# Altium project Hydra A1 UCLO 35131D.PrjPCB (part 11 of 14)
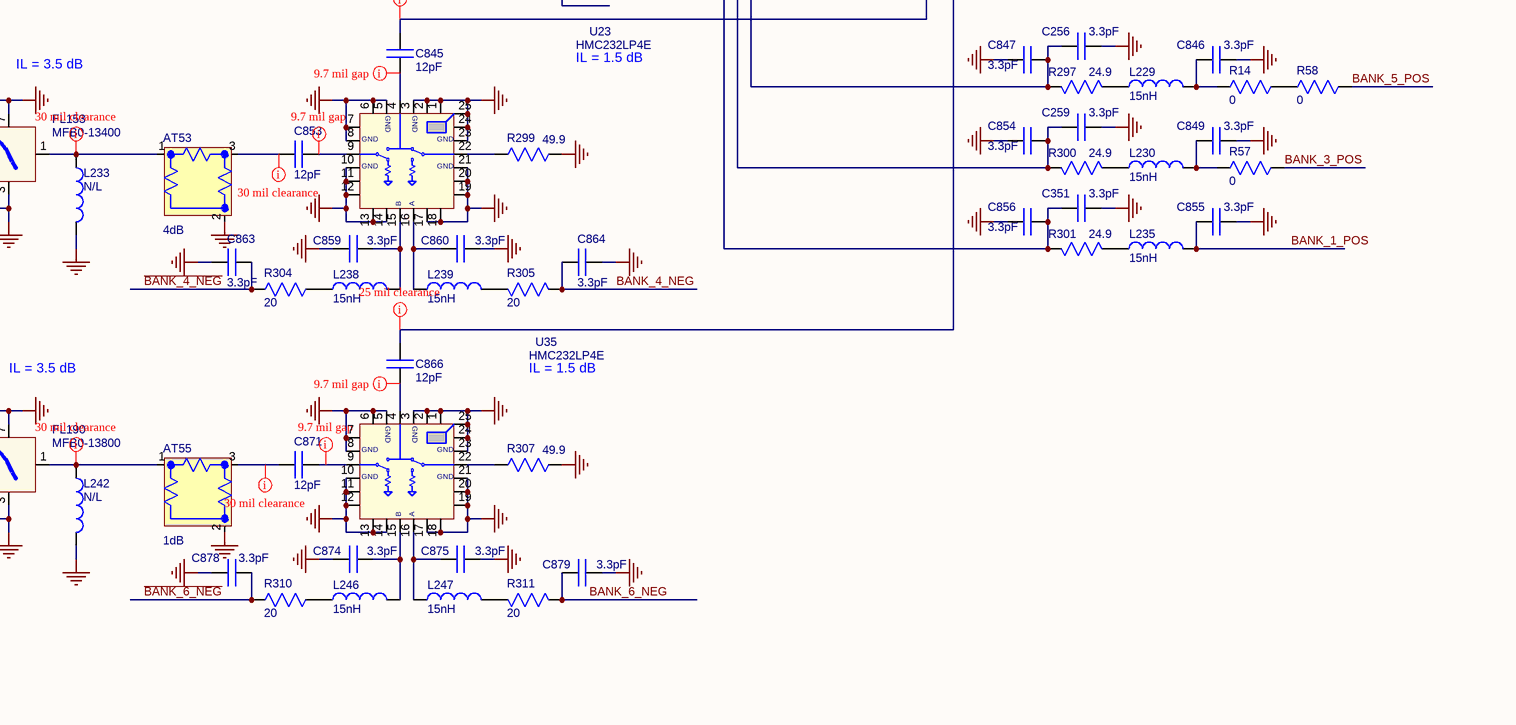
[diagram p75: STALO_2.SchDoc, bottom right]

## Sheet STALO_2.SchDoc: STALO_2 (continued)

### Library data of the parts
AT2 AT5 AT9 AT11 AT15 AT54 AT59 AT62 = MPFC-A1002: NoLoad: .; Approved: CL; M_PN: IMS1141-02DB; MFGR: IMS RESISTORS; level: 1; line_number: 10; ModifyDate: 3/8/13; G_PN: MPFC-A1002; item_number: MPFC-A1002
AT4 AT7 AT8 AT13 AT53 AT57 = MPFC-A1004: NoLoad: .; Approved: CL; M_PN: IMS1141-04DB; MFGR: IMS RESISTORS; level: 1; line_number: 30; ModifyDate: 3/8/13; G_PN: MPFC-A1004; item_number: MPFC-A1004
AT55 = MPFC-A1001: NoLoad: .; Approved: CL; M_PN: IMS1141-01DB; MFGR: IMS RESISTORS; level: 1; line_number: 15; ModifyDate: 3/8/13; G_PN: MPFC-A1001; item_number: MPFC-A1001
AT61 = MPFC-A1000: NoLoad: .; Approved: CL; M_PN: IMS1141-00DB; MFGR: IMS RESISTORS; level: 1; line_number: 50; ModifyDate: 4/16/13; G_PN: MPFC-A1000; item_number: MPFC-A1000
C18 C20 C25 C29 C111 C113 C114 C116 C188 C200 C201 C203 C401 C722 C822 C828 C829 C831 C845 C850 C851 C853 C866 C868 C869 C871 C881 = CK40-00120: Approved: CL; NoLoad: .; MFGR: ANY; level: 1; line_number: 165; G_PN: CK40-00120; ModifyDate: 10/06/12; M_PN: ANY; item_number: CK40-00120
C102-C105 C108 C109 C117 C118 C148-C152 C175-C179 C182-C186 C191-C193 C195-C199 C232-C234 C241 C253-C256 C259 C351-C357 C365-C367 C399 C400 C826 C827 C832-C839 C842 C843 C846 C847 C849 C854-C864 C872-C879 = CK35-00033: MFGR: VENKEL; M_PN: C0201C0G500-3R3BNP; Approved: CL; NoLoad: .; level: 1; line_number: 155; ModifyDate: 6/24/13; G_PN: CK35-00033; item_number: CK35-00033
C106 C107 C115 C180 C181 C840 C841 C886 C891 C893 C953-C955 C965-C967 = CK41-00024: MFGR: ATC; M_PN: 600L2R4AT200; Approved: CL; NoLoad: .; level: 1; line_number: 60; ModifyDate: 02/09/13; G_PN: CK41-00024; item_number: CK41-00024
C189 C190 C823 C825 C892 = CK40-04100: Approved: CL; MFGR: VENKEL; M_PN: C0402X7R160-104KNP; NoLoad: .; level: 1; line_number: 95; ModifyDate: 3/29/13; G_PN: CK40-04100; item_number: CK40-04100
C361 C961 C1224 = CK45-04100: Approved: CL; NoLoad: .; MFGR: ANY; level: 1; line_number: 105; ModifyDate: 02/22/12; G_PN: CK45-04100; M_PN: ANY; item_number: CK45-04100
C402 C956-C958 C968 = TCC3-03100: Approved: CL; NoLoad: .; MFGR: ATC; M_PN: ATC520L103KT16T; level: 1; line_number: 90; G_PN: TCC3-03100; ModifyDate: 4/26/13; item_number: TCC3-03100
C727 C730 C952 C962-C964 = CK40-00120: MFGR: ANY; Approved: CL; NoLoad: .; level: 1; line_number: 165; ModifyDate: 10/06/12; M_PN: ANY; G_PN: CK40-00120; item_number: CK40-00120
C880 C883 C885 = CK40-00330: Approved: CL; MFGR: ANY; NoLoad: .; level: 1; line_number: 295; ModifyDate: 3/9/13; G_PN: CK40-00330; M_PN: ANY; item_number: CK40-00330
C882 = CK41-00018: Approved: CL; NoLoad: .; M_PN: 600L1R8AT200; MFGR: ATC; level: 1; line_number: 175; G_PN: CK41-00018; ModifyDate: 02/09/13; item_number: CK41-00018
C884 = CK41-00007: Approved: CL; NoLoad: .; M_PN: 600L0R7AT200; MFGR: ATC; level: 1; line_number: 300; G_PN: CK41-00007; ModifyDate: 4/9/13; item_number: CK41-00007
C887-C890 = CK40-01100: MFGR: Any; Approved: CL; NoLoad: .; level: 1; line_number: 70; ModifyDate: 3/21/12; M_PN: Any; G_PN: CK40-01100; item_number: CK40-01100
C959 = CK40-00120: Approved: CL; MFGR: ANY; level: 1; line_number: 165; G_PN: CK40-00120; ModifyDate: 10/06/12; M_PN: ANY; item_number: CK40-00120
C969 C970 C1225-C1229 = CK40-01470: Approved: CL; MFGR: Any; NoLoad: .; level: 1; line_number: 75; ModifyDate: 02/22/12; G_PN: CK40-01470; M_PN: Any; item_number: CK40-01470
FL11 FL22 FL23 FL45 FL49 FL50 = LFS0-00222: Approved: CL; NoLoad: .; M_PN: NFE31PT222Z1E9BL; MFGR: MURATA; level: 1; line_number: 335; G_PN: LFS0-00222; ModifyDate: 02/22/12; Value: 2200pF; item_number: LFS0-00222
FL27 FL28 = MFB0-13600: Approved: CL; NoLoad: .; Value: 940685; MFGR: IMC; level: 1; line_number: 385; ModifyDate: 5/30/13; M_PN: 940685; G_PN: MFB0-13600; item_number: MFB0-13600
FL29 FL33 = MFB0-13200: Approved: CL; MFGR: IMC; NoLoad: .; Value: 940683; level: 1; line_number: 410; ModifyDate: 5/30/13; M_PN: 940683; G_PN: MFB0-13200; item_number: MFB0-13200
FL34 FL37 = MFB0-12800: Approved: CL; MFGR: IMC; NoLoad: .; Value: 940681; level: 1; line_number: 430; ModifyDate: 5/30/13; M_PN: 940681; G_PN: MFB0-12800; item_number: MFB0-12800
FL39 FL48 = MFL0-03900: NoLoad: .; MFGR: Mini-Circuits; Approved: NM; level: 1; line_number: 440; ModifyDate: 11/17/12; M_PN: LFCN-3800; G_PN: MFL0-03900; item_number: MFL0-03900
FL43 FL151 = MFB0-13000: Approved: CL; MFGR: IMC; NoLoad: .; Value: 940682; level: 1; line_number: 455; ModifyDate: 5/30/13; M_PN: 940682; G_PN: MFB0-13000; item_number: MFB0-13000
FL47 FL51 = LFS0-00250: Approved: NM; NoLoad: .; M_PN: NFL18ST207X1C3; MFGR: MURATA; level: 1; line_number: 415; ModifyDate: 02/22/12; Value: 25pF; G_PN: LFS0-00250; item_number: LFS0-00250
FL152 FL153 = MFB0-13400: Approved: CL; MFGR: IMC; NoLoad: .; Value: 940684; level: 1; line_number: 345; ModifyDate: 5/30/13; M_PN: 940684; G_PN: MFB0-13400; item_number: MFB0-13400
FL173 FL190 = MFB0-13800: Approved: CL; NoLoad: .; Value: 940686; MFGR: IMC; level: 1; line_number: 355; ModifyDate: 5/30/13; M_PN: 940686; G_PN: MFB0-13800; item_number: MFB0-13800
FL500 FL501 FL506 = LFS0-00222: Filter EMI 2200PF,1206; Approved: CL; NoLoad: .; M_PN: NFE31PT222Z1E9BL; MFGR: MURATA; level: 1; line_number: 335; G_PN: LFS0-00222; ModifyDate: 02/22/12; Value: 2200pF; item_number: LFS0-00222
FT7 FT18 FT33 = FromToNode: level: 1; Approved: *; G_PN: *; MFGR: *; Value: *
J2 = JRSM-70101: SMPM FD MALE,STRAIGHT SMT, R/A COPLANAR, 4 PIN THRU-HOLE; Value: B012-P93-02; MFGR: GILBERT; Approved: CL; level: 1; line_number: 480; M_PN: B012-P93-02; NoLoad: .; ModifyDate: 10/15/14; G_PN: JRSM-70101; item_number: JRSM-70101
J25 = JRSM-40101: Value: 3287-6101; MFGR: SV MICROWAVE; Approved: CL; level: 1; M_PN: 3287-6101; ModifyDate: 4/10/13; G_PN: JRSM-40101; item_number: JRSM-40101
L5 L89 = 13000220-400: M_PN: 0402CS-40NXGLU; MFGR: COILCRAFT; NoLoad: .; Approved: CL; level: 1; line_number: 600; G_PN: 13000220-400; ModifyDate: 7/2/13; item_number: 13000220-400
L8-L11 L17 L18 L54 L55 L78 L79 L84 L85 L153-L155 L157 L231-L234 L240-L243 = LSA6-02390: MFGR: COILCRAFT; Approved: CL; M_PN: 0402HP-3N9XGLU; level: 1; line_number: 620; ModifyDate: 3/13/13; Value: 3.9nH; G_PN: LSA6-02390; item_number: LSA6-02390
L12 L13 L15 L16 L19 L20 L56 L57 L59 L65-L69 L71 L73 L76 L77 L88 L90 L149-L152 L156 L158-L162 L206 L229 L230 L235-L239 L244-L250 = LSA6-03150: MFGR: COILCRAFT; NoLoad: .; Approved: CL; M_PN: 0402HP-15NXGLU; level: 1; line_number: 515; ModifyDate: 3/8/13; G_PN: LSA6-03150; item_number: LSA6-03150
L504 = LSA3-04390: M_PN: 0603CS-R39XJLU; NoLoad: .; Approved: CL; MFGR: COILCRAFT; level: 1; line_number: 580; G_PN: LSA3-04390; ModifyDate: 02/22/12; item_number: LSA3-04390
R2 R316 = RK40-00113: NoLoad: .; MFGR: ANY; Approved: CL; level: 1; line_number: 730; G_PN: RK40-00113; ModifyDate: 7/2/13; M_PN: ANY; item_number: RK40-00113
R6 R7 R69 R74 R99 R100 R118 R275 R298 R299 R306 R307 = RK35-00499: Approved: CL; NoLoad: .; MFGR: ANY; level: 1; line_number: 650; ModifyDate: 02/22/12; G_PN: RK35-00499; M_PN: ANY; item_number: RK35-00499
R10 R64 R76 R77 R80 R83 R87 R95-R97 R102 R112 R115 R291-R294 R297 R300-R303 R308 R309 = RK35-00249: NoLoad: .; Approved: CL; MFGR: ANY; level: 1; line_number: 655; G_PN: RK35-00249; ModifyDate: 02/22/12; M_PN: ANY; item_number: RK35-00249
R11 R14 R53 R54 R57 R58 = RK40-00000: NoLoad: .; MFGR: ANY; Approved: CL; level: 1; line_number: 710; ModifyDate: 3/27/13; M_PN: ANY; G_PN: RK40-00000; item_number: RK40-00000
R65 R66 R88 R91 R113 R114 R295 R296 R304 R305 R310 R311 = RK30-00200: NoLoad: .; Approved: CL; MFGR: Vishay-Dale; M_PN: CRCW020120R0FNED; level: 1; line_number: 782; G_PN: RK30-00200; ModifyDate: 7/24/13; item_number: RK30-00200
R671 = RK65-00392: NoLoad: .; MFGR: VISHAY/DALE; Approved: CL; M_PN: CRCW201039R2FKEF; level: 1; line_number: 892; ModifyDate: 10/14/14; G_PN: RK65-00392; item_number: RK65-00392
R672 = RK65-01107: NoLoad: .; MFGR: VISHAY/DALE; Approved: CL; M_PN: CRCW2010107RFKEF; level: 1; line_number: 715; ModifyDate: 4/23/13; G_PN: RK65-01107; item_number: RK65-01107
R781 R782 = RK65-00499: NoLoad: .; MFGR: ROHM; Approved: CL; M_PN: MCR50JZHF49R9; level: 1; line_number: 1035; ModifyDate: 4/26/12; G_PN: RK65-00499; item_number: RK65-00499
U4 U7-U10 U13 U18 U20 U22 U23 U25 U35 = MRSS-12012: MFGR: HITTITE; Approved: CL; Value: HMC232LP4E; NoLoad: .; level: 1; line_number: 1210; ModifyDate: 4/8/13; G_PN: MRSS-12012; item_number: MRSS-12012
U15 U17 = MRSS-16004: MFGR: HITTITE; Approved: CL; Value: MASWCC0006; NoLoad: .; level: 1; line_number: 1135; ModifyDate: 4/8/13; G_PN: MRSS-16004; item_number: MRSS-16004
U31 U33 = MA20-00006: M_PN: SKY65017-70LF; Approved: CL; MFGR: SKYWORKS; NoLoad: .; Value: SKY65017-70LF; level: 1; line_number: 1160; G_PN: MA20-00006; ModifyDate: 6/26/14; item_number: MA20-00006
U82 = MMDC-00204: Value: LT5579IUH#PBF; NoLoad: .; Approved: CL; MFGR: LINEAR TECH; level: 1; line_number: 1315; ModifyDate: 2/26/13; G_PN: MMDC-00204; item_number: MMDC-00204
U169 = MA12-10001: M_PN: MAV-11BSM+; NoLoad: .; Approved: CL; MFGR: MINI-CIRCUITS; Value: MAV-11BSM+; level: 1; line_number: 1155; ModifyDate: 5/24/13; G_PN: MA12-10001; item_number: MA12-10001
X5 = LTR4-S0104: M_PN: MABAES0061; NoLoad: .; MFGR: MACOM TECH; Approved: CL; Value: MABAES0061; level: 1; line_number: 1085; ModifyDate: 6/1/13; G_PN: LTR4-S0104; item_number: LTR4-S0104

## Sheet STALO_1.SchDoc: STALO_1
size D; Date: 09-24-10; DrawnBy: C. Lewis; Engineer: C. Lewis; Address1: 4650 NORRIS CANYON RD.; Address2: SAN RAMON, CA 94583; DocumentNumber: 35133; Revision: D; SheetNumber: 18; SheetTotal: 20; PageSetup: Record=PageOptions|CenterHorizontal=True|CenterVertical=True|PrintScale=0.51|XCorrection=1.00|YCorrection=1.00|PrintKind=1|BorderSize=5000000|LeftOffset=0|BottomOffset=0|Orientation=2|PaperLength=1000|PaperWidth=1000|Scale=100|PaperSource=15|PrintQuality=600|MediaType=1|DitherType=10|PaperKind=11x17|PrintScaleMode=1; DocumentName: Sheet1.SCHDOC; ModifiedDate: 10-27-11
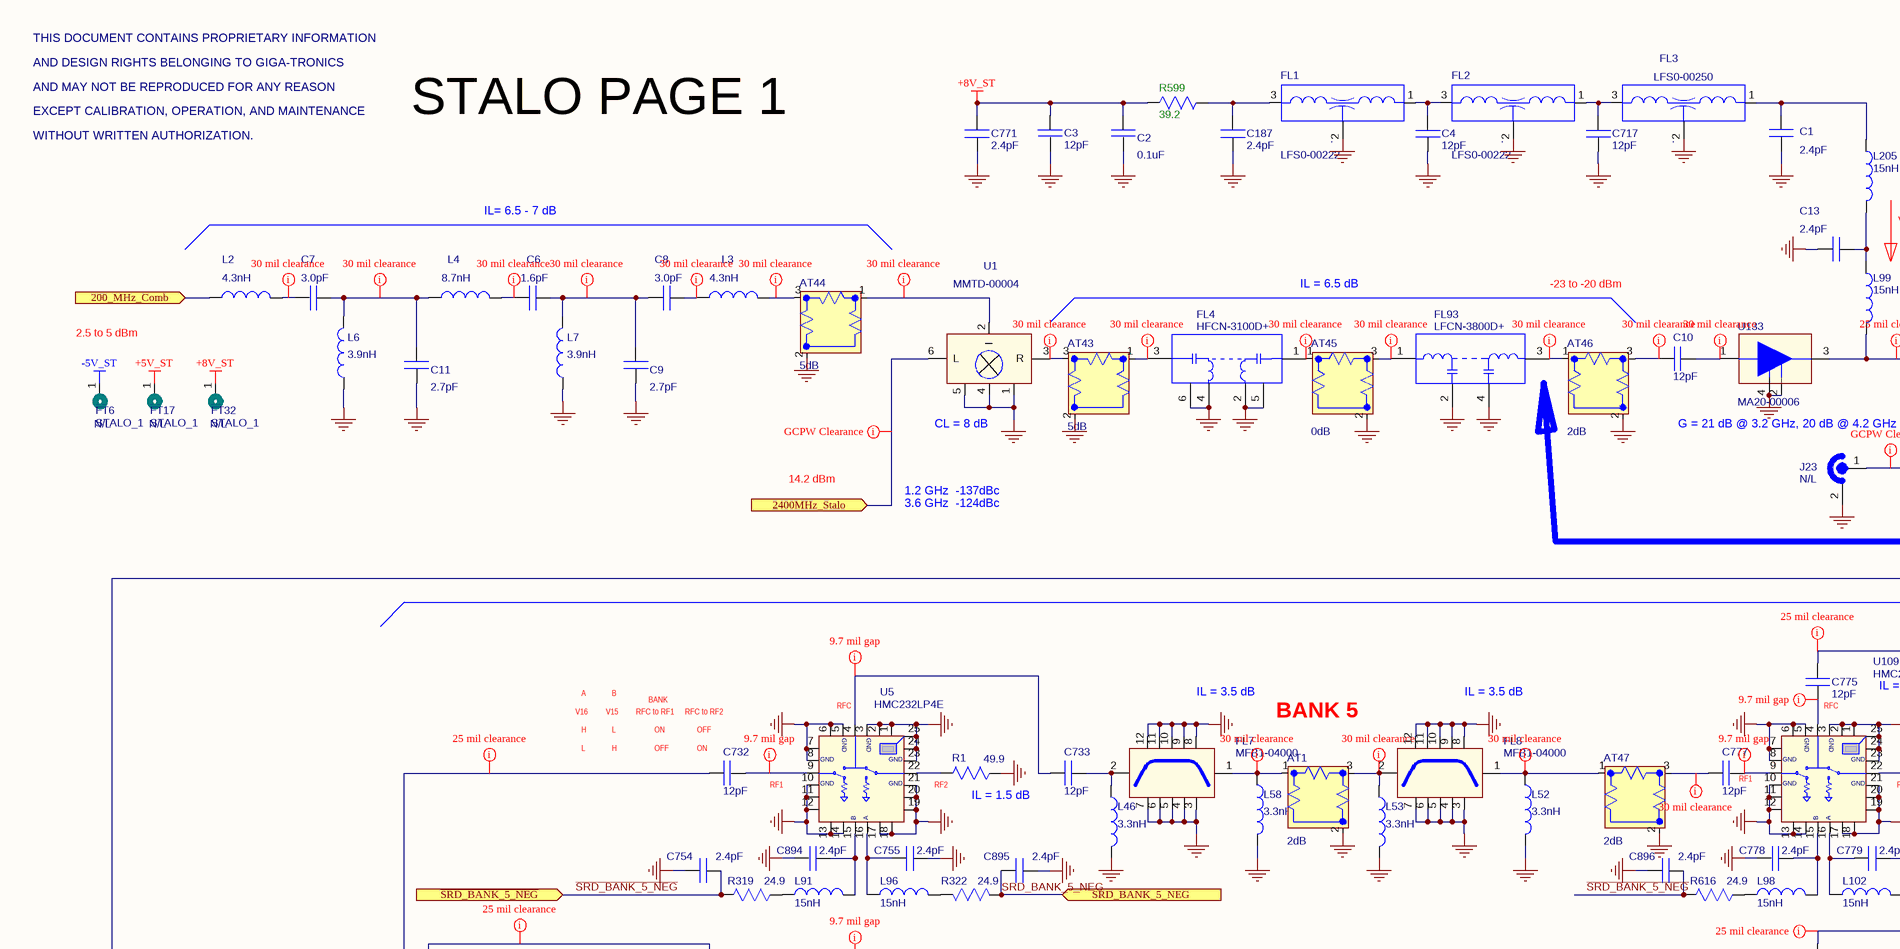
[diagram p57: STALO_1.SchDoc, top left]
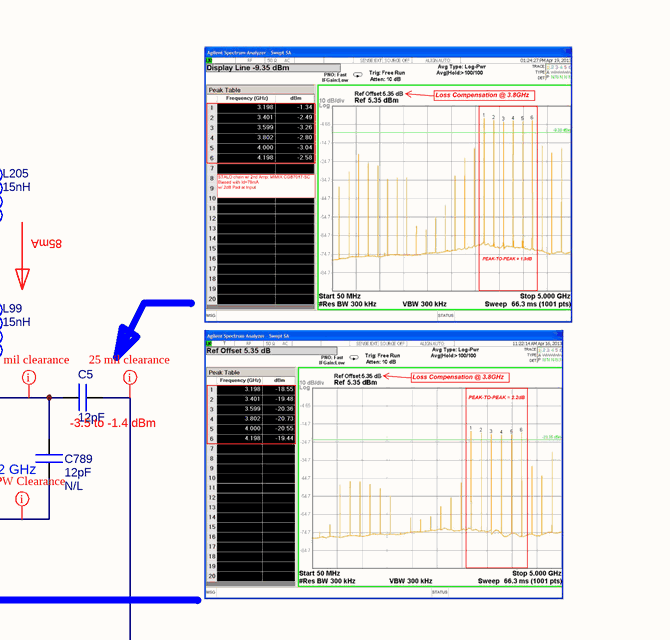
[diagram p58: STALO_1.SchDoc, top right]
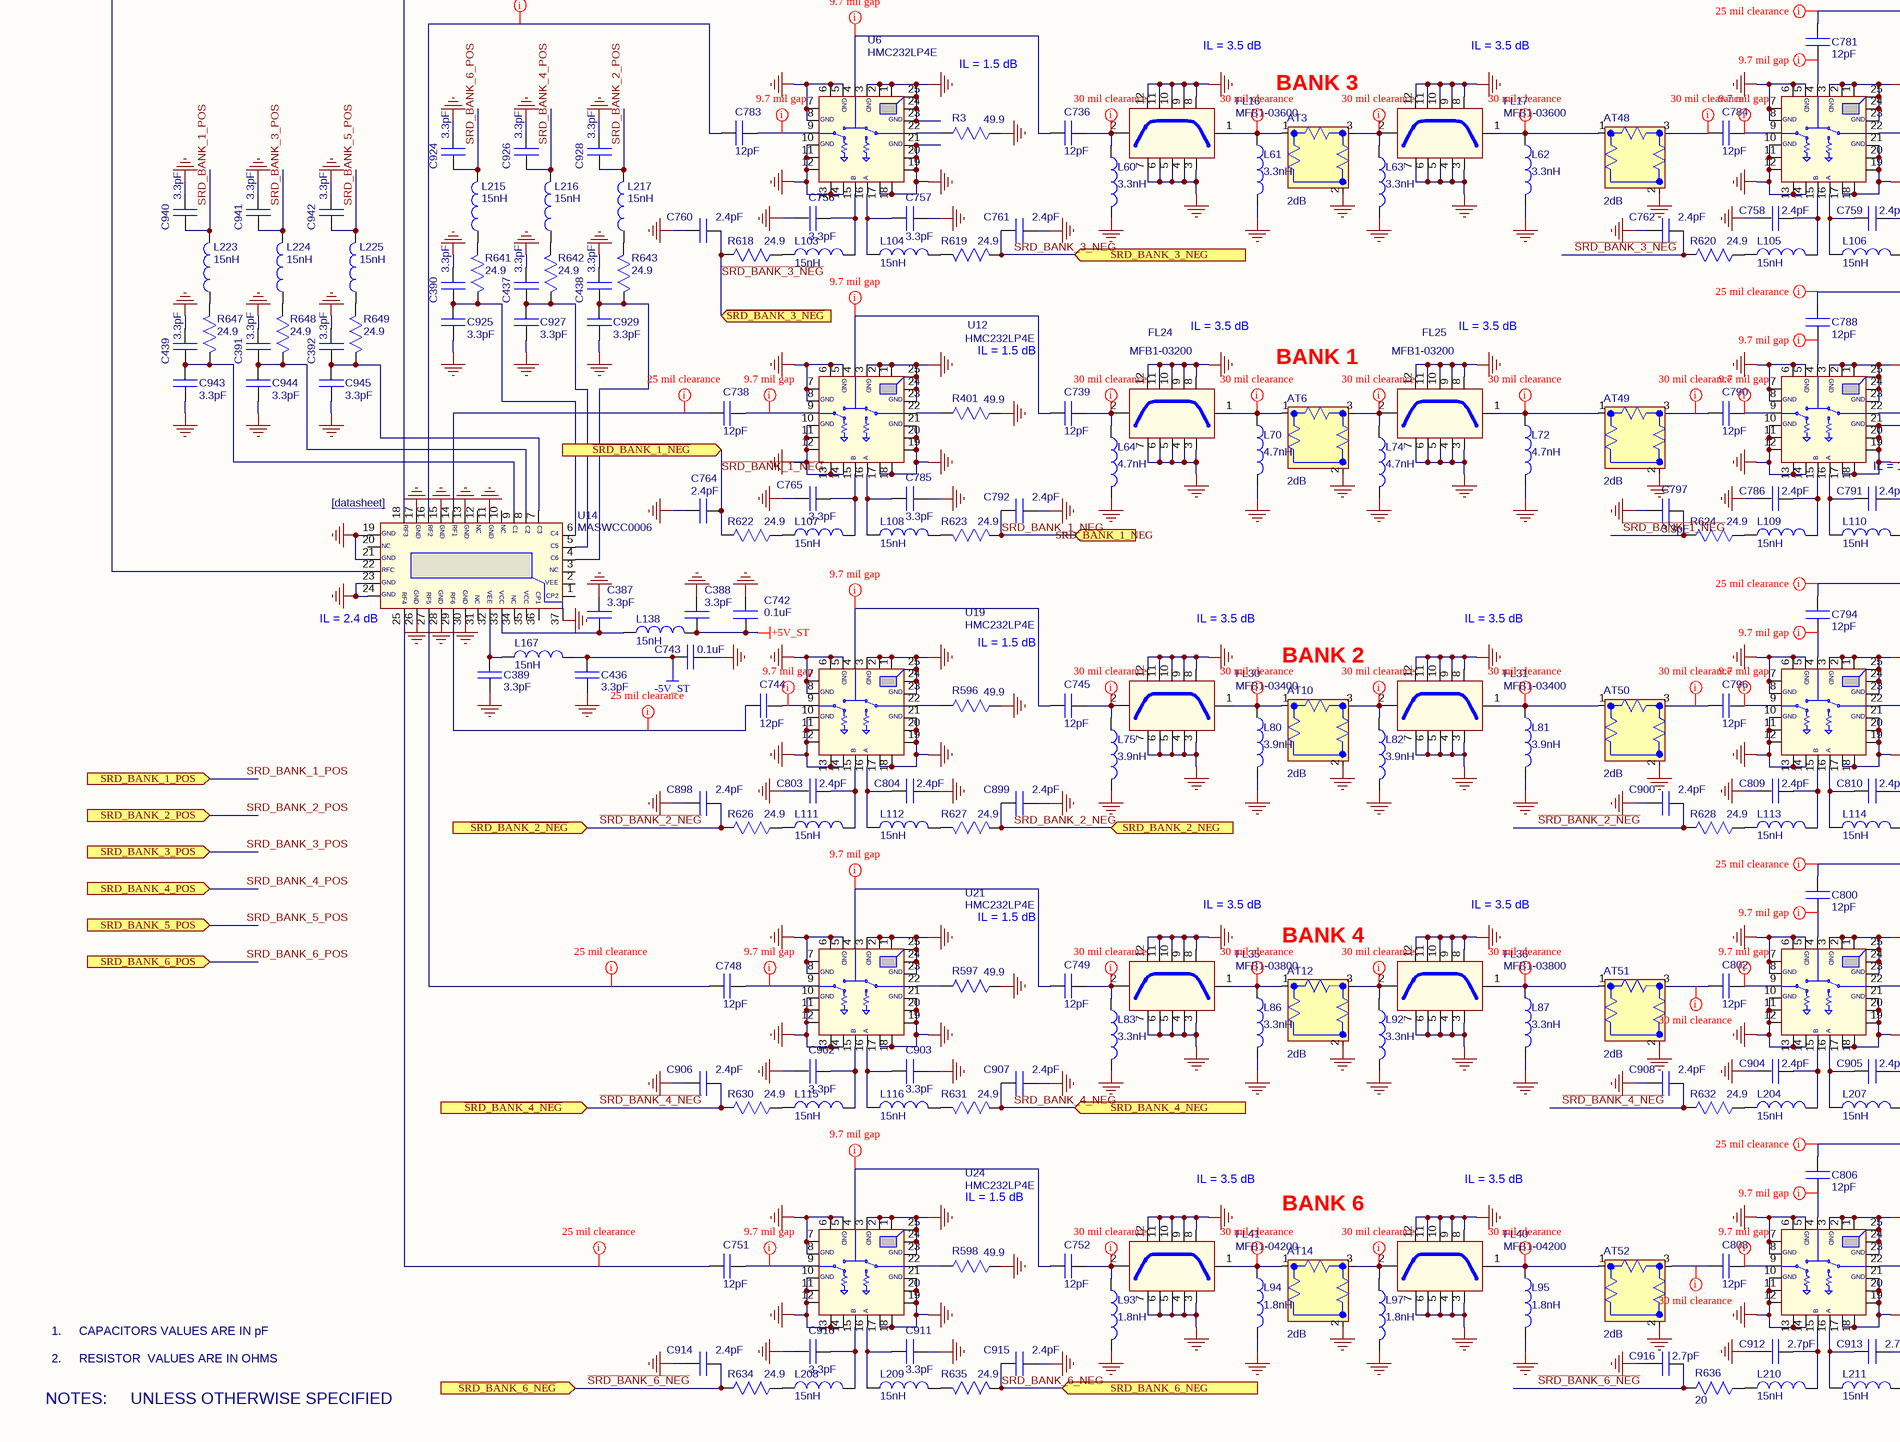
[diagram p59: STALO_1.SchDoc, bottom left]
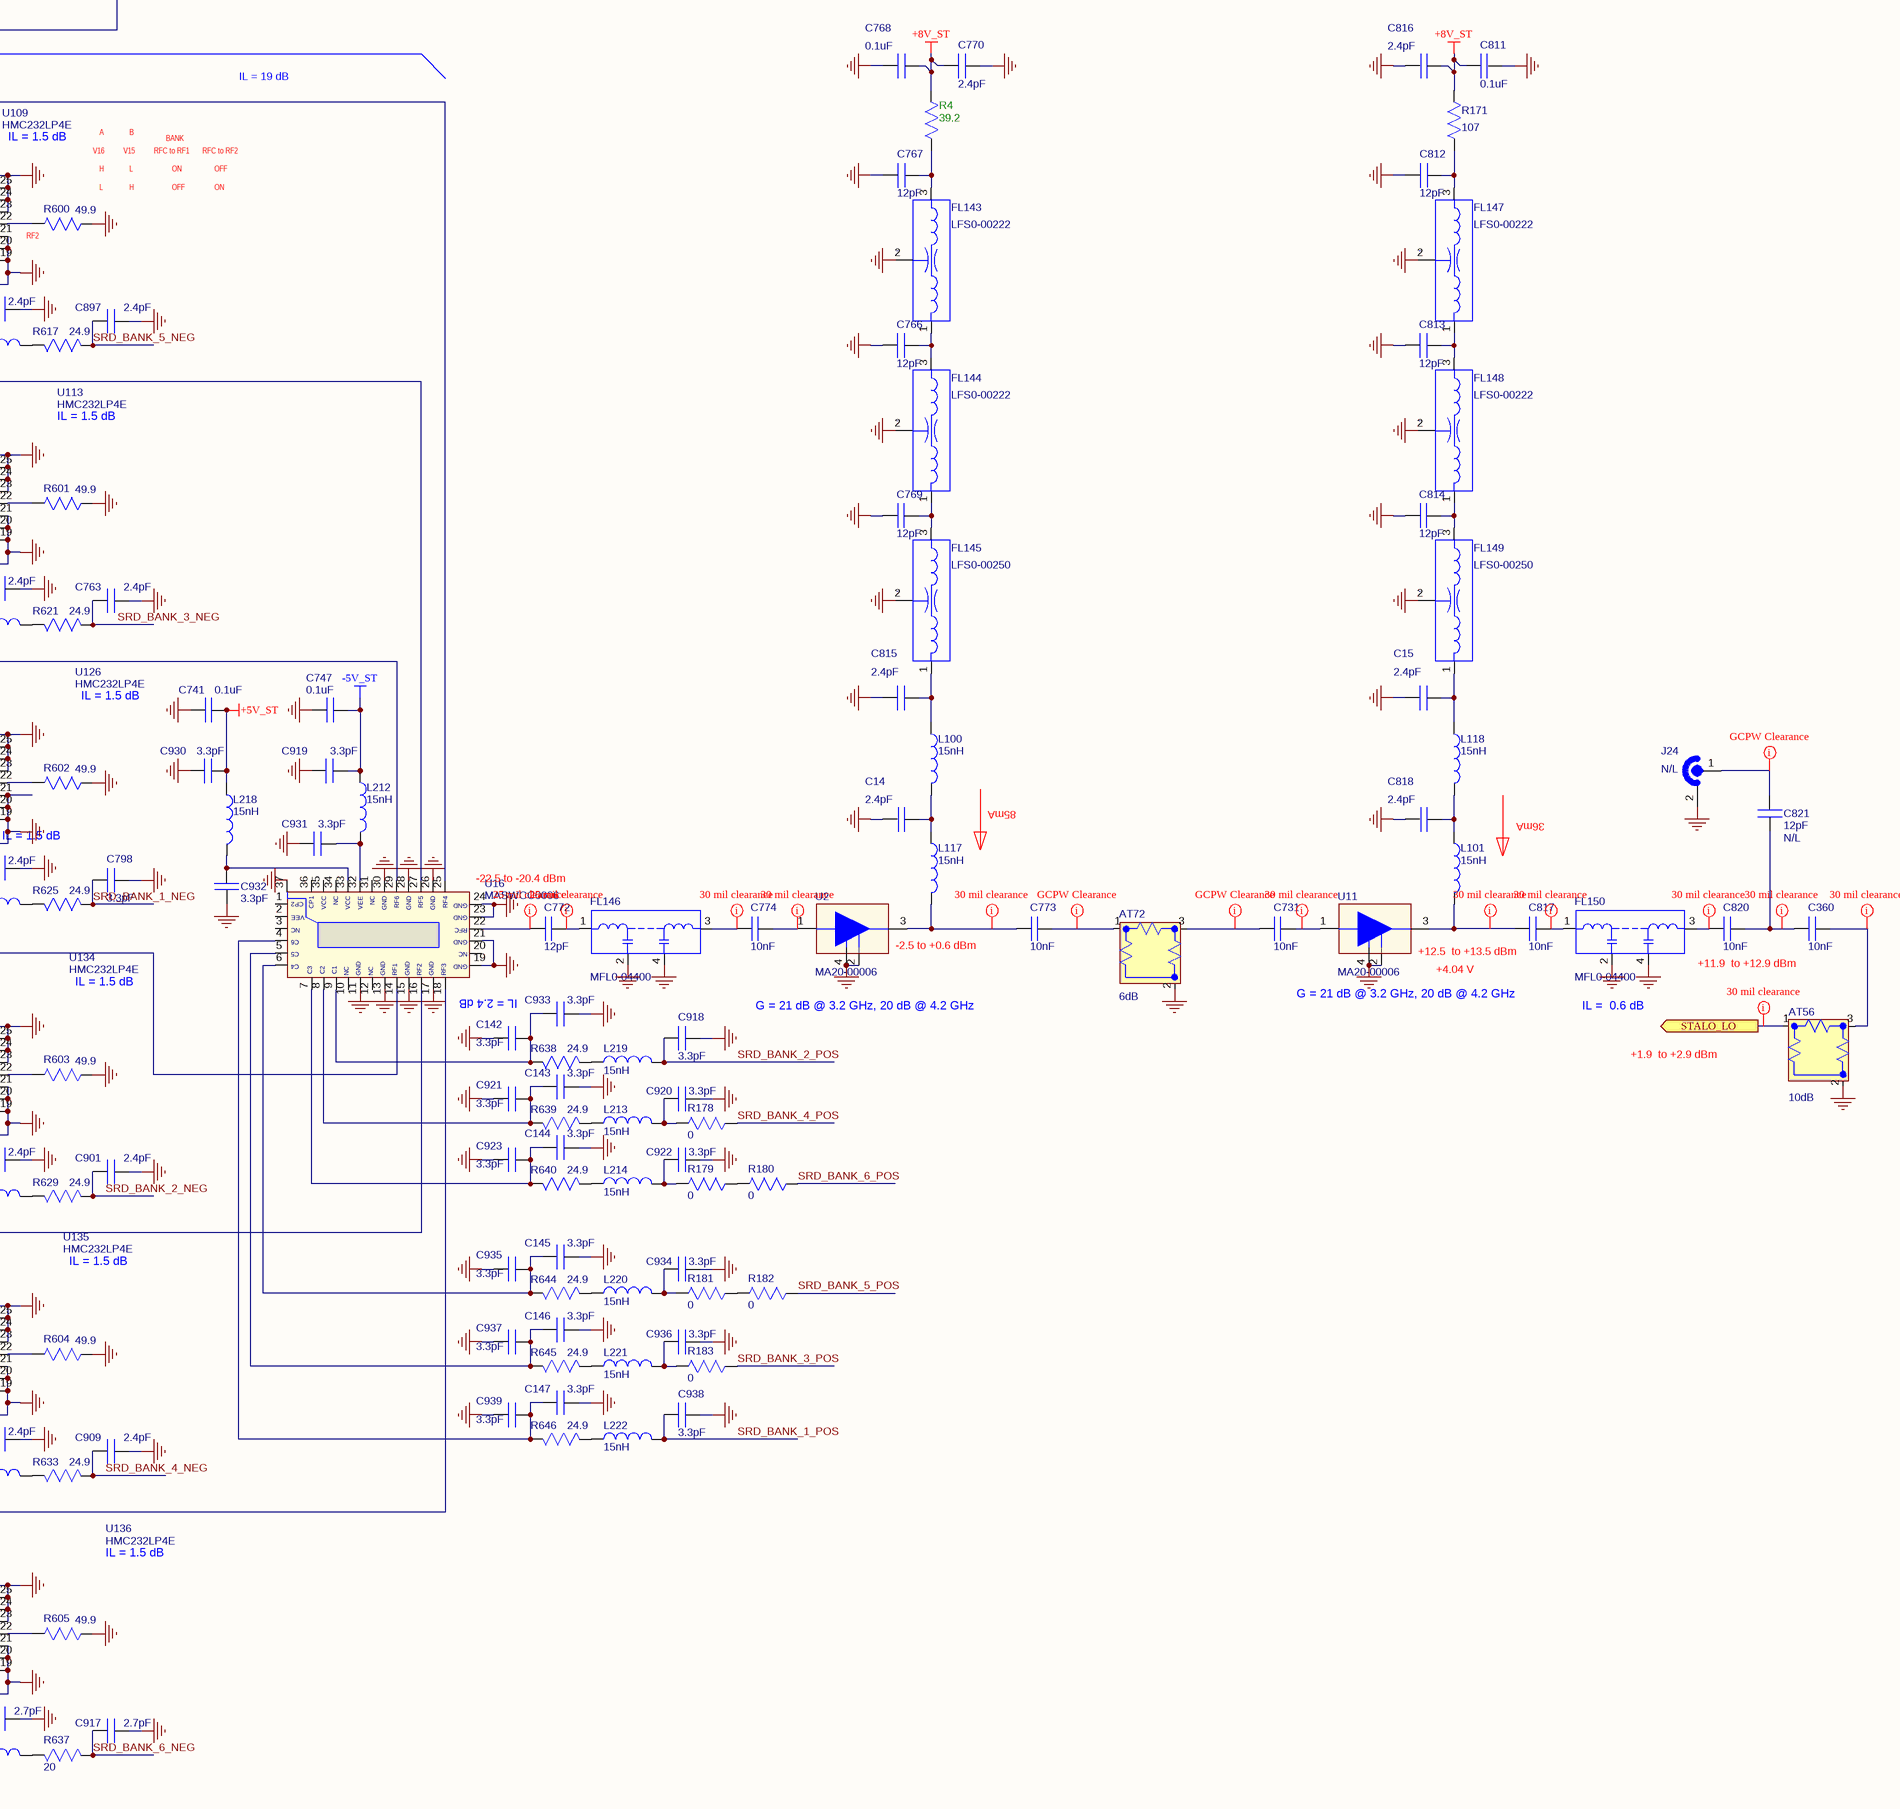
[diagram p60: STALO_1.SchDoc, bottom right]

### Parts
AT1  value 2dB  [ATTN-IMS-0805]  (hidden comment: PAD;CHIP;2dB;+/-.3dB;.08 x .05;50 OHM;FACE DOWN)
AT3  value 2dB  [ATTN-IMS-0805]  (hidden comment: PAD;CHIP;2dB;+/-.3dB;.08 x .05;50 OHM;FACE DOWN)
AT6  value 2dB  [ATTN-IMS-0805]  (hidden comment: PAD;CHIP;2dB;+/-.3dB;.08 x .05;50 OHM;FACE DOWN)
AT10  value 2dB  [ATTN-IMS-0805]  (hidden comment: PAD;CHIP;2dB;+/-.3dB;.08 x .05;50 OHM;FACE DOWN)
AT12  value 2dB  [ATTN-IMS-0805]  (hidden comment: PAD;CHIP;2dB;+/-.3dB;.08 x .05;50 OHM;FACE DOWN)
AT14  value 2dB  [ATTN-IMS-0805]  (hidden comment: PAD;CHIP;2dB;+/-.3dB;.08 x .05;50 OHM;FACE DOWN)
AT43  value 5dB  [ATTN-IMS-0805]  (hidden comment: PAD;CHIP;5dB;+/-.3dB;.08 x .05;50 OHM;FACE DOWN)
AT44  value 5dB  [ATTN-IMS-0805]  (hidden comment: PAD;CHIP;5dB;+/-.3dB;.08 x .05;50 OHM;FACE DOWN)
AT45  value 0dB  [ATTN-IMS-0805]  (hidden comment: PAD;CHIP;0dB;+/-.3dB;.08 x .05;50 OHM;FACE DOWN)
AT46  value 2dB  [ATTN-IMS-0805]  (hidden comment: PAD;CHIP;2dB;+/-.3dB;.08 x .05;50 OHM;FACE DOWN)
AT47  value 2dB  [ATTN-IMS-0805]  (hidden comment: PAD;CHIP;2dB;+/-.3dB;.08 x .05;50 OHM;FACE DOWN)
AT48  value 2dB  [ATTN-IMS-0805]  (hidden comment: PAD;CHIP;2dB;+/-.3dB;.08 x .05;50 OHM;FACE DOWN)
AT49  value 2dB  [ATTN-IMS-0805]  (hidden comment: PAD;CHIP;2dB;+/-.3dB;.08 x .05;50 OHM;FACE DOWN)
AT50  value 2dB  [ATTN-IMS-0805]  (hidden comment: PAD;CHIP;2dB;+/-.3dB;.08 x .05;50 OHM;FACE DOWN)
AT51  value 2dB  [ATTN-IMS-0805]  (hidden comment: PAD;CHIP;2dB;+/-.3dB;.08 x .05;50 OHM;FACE DOWN)
AT52  value 2dB  [ATTN-IMS-0805]  (hidden comment: PAD;CHIP;2dB;+/-.3dB;.08 x .05;50 OHM;FACE DOWN)
AT56  value 10dB  [ATTN-IMS-0805]  (hidden comment: PAD;CHIP;10dB;+/-.3dB;.08 x .05;50 OHM;FACE DOWN)
AT72  value 6dB  [ATTN-IMS-0805]  (hidden comment: PAD;CHIP;6dB;+/-.3dB;.08 x .05;50 OHM;FACE DOWN)
C1  value 2.4pF  [CAP-0402-RF]  (hidden comment: 2.4 PF;200V;.05PF;HIGH Q;SMT;CERAMIC;0402)
C2  value 0.1uF  [CAP-0603-H035-N]  (hidden comment: .1UF;10%;X7R;16V;CHIP;0603)
C3  value 12pF  [CAP-0402-N]  (hidden comment: 12 PF;5%;COG;>50V;CHIP;0402)
C4  value 12pF  [CAP-0402-N]  (hidden comment: 12 PF;5%;COG;>50V;CHIP;0402)
C5  value 12pF  [CAP-0402-N]  (hidden comment: 12 PF;5%;COG;>50V;CHIP;0402)
C6  value 1.6pF  [CAP-0402-RF]  (hidden comment: 1.6 PF;200V;.05PF;HIGH Q;SMT;CERAMIC;0402)
C7  value 3.0pF  [CAP-0402-RF]  (hidden comment: 3.0 PF;200V;.05PF;HIGH Q;SMT;CERAMIC;0402)
C8  value 3.0pF  [CAP-0402-RF]  (hidden comment: 3.0 PF;200V;.05PF;HIGH Q;SMT;CERAMIC;0402)
C9  value 2.7pF  [CAP-0402-RF]  (hidden comment: 2.7 PF;200V;.05PF;HIGH Q;SMT;CERAMIC;0402)
C10  value 12pF  [CAP-0402-N]  (hidden comment: 12 PF;5%;COG;>50V;CHIP;0402)
C11  value 2.7pF  [CAP-0402-RF]  (hidden comment: 2.7 PF;200V;.05PF;HIGH Q;SMT;CERAMIC;0402)
C13  value 2.4pF  [CAP-0402-RF]  (hidden comment: 2.4 PF;200V;.05PF;HIGH Q;SMT;CERAMIC;0402)
C14  value 2.4pF  [CAP-0402-RF]  (hidden comment: 2.4 PF;200V;.05PF;HIGH Q;SMT;CERAMIC;0402)
C15  value 2.4pF  [CAP-0402-RF]  (hidden comment: 2.4 PF;200V;.05PF;HIGH Q;SMT;CERAMIC;0402)
C142  value 3.3pF  [CAP-0201-N]  (hidden comment: 3.3pF;5%;COG;50V;CHIP;0201)
C143  value 3.3pF  [CAP-0201-N]  (hidden comment: 3.3pF;5%;COG;50V;CHIP;0201)
C144  value 3.3pF  [CAP-0201-N]  (hidden comment: 3.3pF;5%;COG;50V;CHIP;0201)
C145  value 3.3pF  [CAP-0201-N]  (hidden comment: 3.3pF;5%;COG;50V;CHIP;0201)
C146  value 3.3pF  [CAP-0201-N]  (hidden comment: 3.3pF;5%;COG;50V;CHIP;0201)
C147  value 3.3pF  [CAP-0201-N]  (hidden comment: 3.3pF;5%;COG;50V;CHIP;0201)
C187  value 2.4pF  [CAP-0402-RF]  (hidden comment: 2.4 PF;200V;.05PF;HIGH Q;SMT;CERAMIC;0402)
C360  value 10nF  [CAP-0402-N]  (hidden comment: 10nF;10%;X7R;16 WVDC;CHIP;0402)
C387  value 3.3pF  [CAP-0201-N]  (hidden comment: 3.3pF;5%;COG;50V;CHIP;0201)
C388  value 3.3pF  [CAP-0201-N]  (hidden comment: 3.3pF;5%;COG;50V;CHIP;0201)
C389  value 3.3pF  [CAP-0201-N]  (hidden comment: 3.3pF;5%;COG;50V;CHIP;0201)
C390  value 3.3pF  [CAP-0201-N]  (hidden comment: 3.3pF;5%;COG;50V;CHIP;0201)
C391  value 3.3pF  [CAP-0201-N]  (hidden comment: 3.3pF;5%;COG;50V;CHIP;0201)
C392  value 3.3pF  [CAP-0201-N]  (hidden comment: 3.3pF;5%;COG;50V;CHIP;0201)
C436  value 3.3pF  [CAP-0201-N]  (hidden comment: 3.3pF;5%;COG;50V;CHIP;0201)
C437  value 3.3pF  [CAP-0201-N]  (hidden comment: 3.3pF;5%;COG;50V;CHIP;0201)
C438  value 3.3pF  [CAP-0201-N]  (hidden comment: 3.3pF;5%;COG;50V;CHIP;0201)
C439  value 3.3pF  [CAP-0201-N]  (hidden comment: 3.3pF;5%;COG;50V;CHIP;0201)
C717  value 12pF  [CAP-0402-N]  (hidden comment: 12 PF;5%;COG;>50V;CHIP;0402)
C731  value 10nF  [CAP-0402-N]  (hidden comment: 10nF;10%;X7R;16 WVDC;CHIP;0402)
C732  value 12pF  [CAP-0402-N]  (hidden comment: 12 PF;5%;COG;>50V;CHIP;0402)
C733  value 12pF  [CAP-0402-N]  (hidden comment: 12 PF;5%;COG;>50V;CHIP;0402)
C736  value 12pF  [CAP-0402-N]  (hidden comment: 12 PF;5%;COG;>50V;CHIP;0402)
C738  value 12pF  [CAP-0402-N]  (hidden comment: 12 PF;5%;COG;>50V;CHIP;0402)
C739  value 12pF  [CAP-0402-N]  (hidden comment: 12 PF;5%;COG;>50V;CHIP;0402)
C741  value 0.1uF  [CAP-0402-N]  (hidden comment: .1 UF,10%;X7R;16V,CHIP;0402)
C742  value 0.1uF  [CAP-0402-N]  (hidden comment: .1 UF,10%;X7R;16V,CHIP;0402)
C743  value 0.1uF  [CAP-0402-N]  (hidden comment: .1 UF,10%;X7R;16V,CHIP;0402)
C744  value 12pF  [CAP-0402-N]  (hidden comment: 12 PF;5%;COG;>50V;CHIP;0402)
C745  value 12pF  [CAP-0402-N]  (hidden comment: 12 PF;5%;COG;>50V;CHIP;0402)
C747  value 0.1uF  [CAP-0402-N]  (hidden comment: .1 UF,10%;X7R;16V,CHIP;0402)
C748  value 12pF  [CAP-0402-N]  (hidden comment: 12 PF;5%;COG;>50V;CHIP;0402)
C749  value 12pF  [CAP-0402-N]  (hidden comment: 12 PF;5%;COG;>50V;CHIP;0402)
C751  value 12pF  [CAP-0402-N]  (hidden comment: 12 PF;5%;COG;>50V;CHIP;0402)
C752  value 12pF  [CAP-0402-N]  (hidden comment: 12 PF;5%;COG;>50V;CHIP;0402)
C754  value 2.4pF  [CAP-0402-RF]  (hidden comment: 2.4 PF;200V;.05PF;HIGH Q;SMT;CERAMIC;0402)
C755  value 2.4pF  [CAP-0402-RF]  (hidden comment: 2.4 PF;200V;.05PF;HIGH Q;SMT;CERAMIC;0402)
C756  value 3.3pF  [CAP-0201-N]  (hidden comment: 3.3pF;5%;COG;50V;CHIP;0201)
C757  value 3.3pF  [CAP-0201-N]  (hidden comment: 3.3pF;5%;COG;50V;CHIP;0201)
C758  value 2.4pF  [CAP-0402-RF]  (hidden comment: 2.4 PF;200V;.05PF;HIGH Q;SMT;CERAMIC;0402)
C759  value 2.4pF  [CAP-0402-RF]  (hidden comment: 2.4 PF;200V;.05PF;HIGH Q;SMT;CERAMIC;0402)
C760  value 2.4pF  [CAP-0402-RF]  (hidden comment: 2.4 PF;200V;.05PF;HIGH Q;SMT;CERAMIC;0402)
C761  value 2.4pF  [CAP-0402-RF]  (hidden comment: 2.4 PF;200V;.05PF;HIGH Q;SMT;CERAMIC;0402)
C762  value 2.4pF  [CAP-0402-RF]  (hidden comment: 2.4 PF;200V;.05PF;HIGH Q;SMT;CERAMIC;0402)
C763  value 2.4pF  [CAP-0402-RF]  (hidden comment: 2.4 PF;200V;.05PF;HIGH Q;SMT;CERAMIC;0402)
C764  value 2.4pF  [CAP-0402-RF]  (hidden comment: 2.4 PF;200V;.05PF;HIGH Q;SMT;CERAMIC;0402)
C765  value 3.3pF  [CAP-0201-N]  (hidden comment: 3.3pF;5%;COG;50V;CHIP;0201)
C766  value 12pF  [CAP-0402-N]  (hidden comment: 12 PF;5%;COG;>50V;CHIP;0402)
C767  value 12pF  [CAP-0402-N]  (hidden comment: 12 PF;5%;COG;>50V;CHIP;0402)
C768  value 0.1uF  [CAP-0603-H035-N]  (hidden comment: .1UF;10%;X7R;16V;CHIP;0603)
C769  value 12pF  [CAP-0402-N]  (hidden comment: 12 PF;5%;COG;>50V;CHIP;0402)
C770  value 2.4pF  [CAP-0402-RF]  (hidden comment: 2.4 PF;200V;.05PF;HIGH Q;SMT;CERAMIC;0402)
C771  value 2.4pF  [CAP-0402-RF]  (hidden comment: 2.4 PF;200V;.05PF;HIGH Q;SMT;CERAMIC;0402)
C772  value 12pF  [CAP-0402-N]  (hidden comment: 12 PF;5%;COG;>50V;CHIP;0402)
C773  value 10nF  [CAP-0402-N]  (hidden comment: 10nF;10%;X7R;16 WVDC;CHIP;0402)
C774  value 10nF  [CAP-0402-N]  (hidden comment: 10nF;10%;X7R;16 WVDC;CHIP;0402)
C775  value 12pF  [CAP-0402-N]  (hidden comment: 12 PF;5%;COG;>50V;CHIP;0402)
C777  value 12pF  [CAP-0402-N]  (hidden comment: 12 PF;5%;COG;>50V;CHIP;0402)
C778  value 2.4pF  [CAP-0402-RF]  (hidden comment: 2.4 PF;200V;.05PF;HIGH Q;SMT;CERAMIC;0402)
C779  value 2.4pF  [CAP-0402-RF]  (hidden comment: 2.4 PF;200V;.05PF;HIGH Q;SMT;CERAMIC;0402)
C781  value 12pF  [CAP-0402-N]  (hidden comment: 12 PF;5%;COG;>50V;CHIP;0402)
C783  value 12pF  [CAP-0402-N]  (hidden comment: 12 PF;5%;COG;>50V;CHIP;0402)
C784  value 12pF  [CAP-0402-N]  (hidden comment: 12 PF;5%;COG;>50V;CHIP;0402)
C785  value 3.3pF  [CAP-0201-N]  (hidden comment: 3.3pF;5%;COG;50V;CHIP;0201)
C786  value 2.4pF  [CAP-0402-RF]  (hidden comment: 2.4 PF;200V;.05PF;HIGH Q;SMT;CERAMIC;0402)
C788  value 12pF  [CAP-0402-N]  (hidden comment: 12 PF;5%;COG;>50V;CHIP;0402)
C789  value 12pF  NoLoad: N/L  [CAP-0402-N]  (hidden comment: 12 PF;5%;COG;>50V;CHIP;0402)
C790  value 12pF  [CAP-0402-N]  (hidden comment: 12 PF;5%;COG;>50V;CHIP;0402)
C791  value 2.4pF  [CAP-0402-RF]  (hidden comment: 2.4 PF;200V;.05PF;HIGH Q;SMT;CERAMIC;0402)
C792  value 2.4pF  [CAP-0402-RF]  (hidden comment: 2.4 PF;200V;.05PF;HIGH Q;SMT;CERAMIC;0402)
C794  value 12pF  [CAP-0402-N]  (hidden comment: 12 PF;5%;COG;>50V;CHIP;0402)
C796  value 12pF  [CAP-0402-N]  (hidden comment: 12 PF;5%;COG;>50V;CHIP;0402)
C797  value 3.3pF  [CAP-0201-N]  (hidden comment: 3.3pF;5%;COG;50V;CHIP;0201)
C798  value 3.3pF  [CAP-0201-N]  (hidden comment: 3.3pF;5%;COG;50V;CHIP;0201)
C800  value 12pF  [CAP-0402-N]  (hidden comment: 12 PF;5%;COG;>50V;CHIP;0402)
C802  value 12pF  [CAP-0402-N]  (hidden comment: 12 PF;5%;COG;>50V;CHIP;0402)
C803  value 2.4pF  [CAP-0402-RF]  (hidden comment: 2.4 PF;200V;.05PF;HIGH Q;SMT;CERAMIC;0402)
C804  value 2.4pF  [CAP-0402-RF]  (hidden comment: 2.4 PF;200V;.05PF;HIGH Q;SMT;CERAMIC;0402)
C806  value 12pF  [CAP-0402-N]  (hidden comment: 12 PF;5%;COG;>50V;CHIP;0402)
C808  value 12pF  [CAP-0402-N]  (hidden comment: 12 PF;5%;COG;>50V;CHIP;0402)
C809  value 2.4pF  [CAP-0402-RF]  (hidden comment: 2.4 PF;200V;.05PF;HIGH Q;SMT;CERAMIC;0402)
C810  value 2.4pF  [CAP-0402-RF]  (hidden comment: 2.4 PF;200V;.05PF;HIGH Q;SMT;CERAMIC;0402)
C811  value 0.1uF  [CAP-0603-H035-N]  (hidden comment: .1UF;10%;X7R;16V;CHIP;0603)
C812  value 12pF  [CAP-0402-N]  (hidden comment: 12 PF;5%;COG;>50V;CHIP;0402)
C813  value 12pF  [CAP-0402-N]  (hidden comment: 12 PF;5%;COG;>50V;CHIP;0402)
C814  value 12pF  [CAP-0402-N]  (hidden comment: 12 PF;5%;COG;>50V;CHIP;0402)
C815  value 2.4pF  [CAP-0402-RF]  (hidden comment: 2.4 PF;200V;.05PF;HIGH Q;SMT;CERAMIC;0402)
C816  value 2.4pF  [CAP-0402-RF]  (hidden comment: 2.4 PF;200V;.05PF;HIGH Q;SMT;CERAMIC;0402)
C817  value 10nF  [CAP-0402-N]  (hidden comment: 10nF;10%;X7R;16 WVDC;CHIP;0402)
C818  value 2.4pF  [CAP-0402-RF]  (hidden comment: 2.4 PF;200V;.05PF;HIGH Q;SMT;CERAMIC;0402)
C820  value 10nF  [CAP-0402-N]  (hidden comment: 10nF;10%;X7R;16 WVDC;CHIP;0402)
C821  value 12pF  NoLoad: N/L  [CAP-0402-N]  (hidden comment: 12 PF;5%;COG;>50V;CHIP;0402)
C894  value 2.4pF  [CAP-0402-RF]  (hidden comment: 2.4 PF;200V;.05PF;HIGH Q;SMT;CERAMIC;0402)
C895  value 2.4pF  [CAP-0402-RF]  (hidden comment: 2.4 PF;200V;.05PF;HIGH Q;SMT;CERAMIC;0402)
C896  value 2.4pF  [CAP-0402-RF]  (hidden comment: 2.4 PF;200V;.05PF;HIGH Q;SMT;CERAMIC;0402)
C897  value 2.4pF  [CAP-0402-RF]  (hidden comment: 2.4 PF;200V;.05PF;HIGH Q;SMT;CERAMIC;0402)
C898  value 2.4pF  [CAP-0402-RF]  (hidden comment: 2.4 PF;200V;.05PF;HIGH Q;SMT;CERAMIC;0402)
C899  value 2.4pF  [CAP-0402-RF]  (hidden comment: 2.4 PF;200V;.05PF;HIGH Q;SMT;CERAMIC;0402)
C900  value 2.4pF  [CAP-0402-RF]  (hidden comment: 2.4 PF;200V;.05PF;HIGH Q;SMT;CERAMIC;0402)
C901  value 2.4pF  [CAP-0402-RF]  (hidden comment: 2.4 PF;200V;.05PF;HIGH Q;SMT;CERAMIC;0402)
C902  value 3.3pF  [CAP-0201-N]  (hidden comment: 3.3pF;5%;COG;50V;CHIP;0201)
C903  value 3.3pF  [CAP-0201-N]  (hidden comment: 3.3pF;5%;COG;50V;CHIP;0201)
C904  value 2.4pF  [CAP-0402-RF]  (hidden comment: 2.4 PF;200V;.05PF;HIGH Q;SMT;CERAMIC;0402)
C905  value 2.4pF  [CAP-0402-RF]  (hidden comment: 2.4 PF;200V;.05PF;HIGH Q;SMT;CERAMIC;0402)
C906  value 2.4pF  [CAP-0402-RF]  (hidden comment: 2.4 PF;200V;.05PF;HIGH Q;SMT;CERAMIC;0402)
C907  value 2.4pF  [CAP-0402-RF]  (hidden comment: 2.4 PF;200V;.05PF;HIGH Q;SMT;CERAMIC;0402)
C908  value 2.4pF  [CAP-0402-RF]  (hidden comment: 2.4 PF;200V;.05PF;HIGH Q;SMT;CERAMIC;0402)
C909  value 2.4pF  [CAP-0402-RF]  (hidden comment: 2.4 PF;200V;.05PF;HIGH Q;SMT;CERAMIC;0402)
C910  value 3.3pF  [CAP-0201-N]  (hidden comment: 3.3pF;5%;COG;50V;CHIP;0201)
C911  value 3.3pF  [CAP-0201-N]  (hidden comment: 3.3pF;5%;COG;50V;CHIP;0201)
C912  value 2.7pF  [CAP-0201-N]  (hidden comment: 2.7pF;5%;COG;50V;CHIP;0201)
C913  value 2.7pF  [CAP-0201-N]  (hidden comment: 2.7pF;5%;COG;50V;CHIP;0201)
C914  value 2.4pF  [CAP-0402-RF]  (hidden comment: 2.4 PF;200V;.05PF;HIGH Q;SMT;CERAMIC;0402)
C915  value 2.4pF  [CAP-0402-RF]  (hidden comment: 2.4 PF;200V;.05PF;HIGH Q;SMT;CERAMIC;0402)
C916  value 2.7pF  [CAP-0201-N]  (hidden comment: 2.7pF;5%;COG;50V;CHIP;0201)
C917  value 2.7pF  [CAP-0201-N]  (hidden comment: 2.7pF;5%;COG;50V;CHIP;0201)
C918  value 3.3pF  [CAP-0201-N]  (hidden comment: 3.3pF;5%;COG;50V;CHIP;0201)
C919  value 3.3pF  [CAP-0201-N]  (hidden comment: 3.3pF;5%;COG;50V;CHIP;0201)
C920  value 3.3pF  [CAP-0201-N]  (hidden comment: 3.3pF;5%;COG;50V;CHIP;0201)
C921  value 3.3pF  [CAP-0201-N]  (hidden comment: 3.3pF;5%;COG;50V;CHIP;0201)
C922  value 3.3pF  [CAP-0201-N]  (hidden comment: 3.3pF;5%;COG;50V;CHIP;0201)
C923  value 3.3pF  [CAP-0201-N]  (hidden comment: 3.3pF;5%;COG;50V;CHIP;0201)
C924  value 3.3pF  [CAP-0201-N]  (hidden comment: 3.3pF;5%;COG;50V;CHIP;0201)
C925  value 3.3pF  [CAP-0201-N]  (hidden comment: 3.3pF;5%;COG;50V;CHIP;0201)
C926  value 3.3pF  [CAP-0201-N]  (hidden comment: 3.3pF;5%;COG;50V;CHIP;0201)
C927  value 3.3pF  [CAP-0201-N]  (hidden comment: 3.3pF;5%;COG;50V;CHIP;0201)
C928  value 3.3pF  [CAP-0201-N]  (hidden comment: 3.3pF;5%;COG;50V;CHIP;0201)
C929  value 3.3pF  [CAP-0201-N]  (hidden comment: 3.3pF;5%;COG;50V;CHIP;0201)
C930  value 3.3pF  [CAP-0201-N]  (hidden comment: 3.3pF;5%;COG;50V;CHIP;0201)
C931  value 3.3pF  [CAP-0201-N]  (hidden comment: 3.3pF;5%;COG;50V;CHIP;0201)
C932  value 3.3pF  [CAP-0201-N]  (hidden comment: 3.3pF;5%;COG;50V;CHIP;0201)
C933  value 3.3pF  [CAP-0201-N]  (hidden comment: 3.3pF;5%;COG;50V;CHIP;0201)
C934  value 3.3pF  [CAP-0201-N]  (hidden comment: 3.3pF;5%;COG;50V;CHIP;0201)
C935  value 3.3pF  [CAP-0201-N]  (hidden comment: 3.3pF;5%;COG;50V;CHIP;0201)
C936  value 3.3pF  [CAP-0201-N]  (hidden comment: 3.3pF;5%;COG;50V;CHIP;0201)
C937  value 3.3pF  [CAP-0201-N]  (hidden comment: 3.3pF;5%;COG;50V;CHIP;0201)
C938  value 3.3pF  [CAP-0201-N]  (hidden comment: 3.3pF;5%;COG;50V;CHIP;0201)
C939  value 3.3pF  [CAP-0201-N]  (hidden comment: 3.3pF;5%;COG;50V;CHIP;0201)
C940  value 3.3pF  [CAP-0201-N]  (hidden comment: 3.3pF;5%;COG;50V;CHIP;0201)
C941  value 3.3pF  [CAP-0201-N]  (hidden comment: 3.3pF;5%;COG;50V;CHIP;0201)
C942  value 3.3pF  [CAP-0201-N]  (hidden comment: 3.3pF;5%;COG;50V;CHIP;0201)
C943  value 3.3pF  [CAP-0201-N]  (hidden comment: 3.3pF;5%;COG;50V;CHIP;0201)
C944  value 3.3pF  [CAP-0201-N]  (hidden comment: 3.3pF;5%;COG;50V;CHIP;0201)
C945  value 3.3pF  [CAP-0201-N]  (hidden comment: 3.3pF;5%;COG;50V;CHIP;0201)
FL1  Filter EMI 2200PF,1206  [FIL-NFE31P-1206-4P]  (value not drawn)
FL2  Filter EMI 2200PF,1206  [FIL-NFE31P-1206-4P]  (value not drawn)
FL3  F/T FILTER;CHIP;2.5 DCR150MA;16V;T LC;25PF;200MHz;0603  [FIL-NFL18ST]  (value not drawn)
FL4  M_PN: HFCN-3100D+  [FV1206-1]  (hidden comment: FILTER;HI PASS;3100MHz;5SEC;FV1206-1;RoHS)
FL7  FILTER;CER;BANDPASS;4000MHZ;70MHZ BW;6-SEC;SMT  [FIL-1060X380X240_2_10P]  (value not drawn)
FL8  FILTER;CER;BANDPASS;4000MHZ;70MHZ BW;6-SEC;SMT  [FIL-1060X380X240_2_10P]  (value not drawn)
FL16  4SD3600-U70-6CC  [FIL-1060X380X240_2_10P]  (value not drawn)
FL17  4SD3600-U70-6CC  [FIL-1060X380X240_2_10P]  (value not drawn)
FL24  FILTER;CER;BANDPASS;3200MHZ;70MHZ BW;6-SEC;SMT  [FIL-1060X380X240_2_10P]  (value not drawn)
FL25  FILTER;CER;BANDPASS;3200MHZ;70MHZ BW;6-SEC;SMT  [FIL-1060X380X240_2_10P]  (value not drawn)
FL30  FILTER;CER;BANDPASS;3400MHZ;70MHZ BW;6-SEC;SMT  [FIL-1060X380X240_2_10P]  (value not drawn)
FL31  FILTER;CER;BANDPASS;3400MHZ;70MHZ BW;6-SEC;SMT  [FIL-1060X380X240_2_10P]  (value not drawn)
FL35  FILTER;CER;BANDPASS;3800MHZ;70MHZ BW;6-SEC;SMT  [FIL-1060X380X240_2_10P]  (value not drawn)
FL36  FILTER;CER;BANDPASS;3800MHZ;70MHZ BW;6-SEC;SMT  [FIL-1060X380X240_2_10P]  (value not drawn)
FL40  FILTER;CER;BANDPASS;4200MHZ;70MHZ BW;6-SEC;SMT  [FIL-1060X380X240_2_10P]  (value not drawn)
FL41  FILTER;CER;BANDPASS;4200MHZ;70MHZ BW;6-SEC;SMT  [FIL-1060X380X240_2_10P]  (value not drawn)
FL93  M_PN: LFCN-3800D+  [FV1206]  (hidden comment: FILTER;LOW PASS;3900MHz;7SEC;RoHS;FV1206)
FL143  Filter EMI 2200PF,1206  [FIL-NFE31P-1206-4P]  (value not drawn)
FL144  Filter EMI 2200PF,1206  [FIL-NFE31P-1206-4P]  (value not drawn)
FL145  F/T FILTER;CHIP;2.5 DCR150MA;16V;T LC;25PF;200MHz;0603  [FIL-NFL18ST]  (value not drawn)
FL146  FILTER;LOW PASS;4400MHz;7SEC;FV1206  [FV1206]  (value not drawn)
FL147  Filter EMI 2200PF,1206  [FIL-NFE31P-1206-4P]  (value not drawn)
FL148  Filter EMI 2200PF,1206  [FIL-NFE31P-1206-4P]  (value not drawn)
FL149  F/T FILTER;CHIP;2.5 DCR150MA;16V;T LC;25PF;200MHz;0603  [FIL-NFL18ST]  (value not drawn)
FL150  FILTER;LOW PASS;4400MHz;7SEC;FV1206  [FV1206]  (value not drawn)
FT6  STALO_1  NoLoad: N/L  [FromToNode_ML2]  (net tie, no BOM)
FT17  STALO_1  NoLoad: N/L  [FromToNode_ML2]  (net tie, no BOM)
FT32  STALO_1  NoLoad: N/L  [FromToNode_ML2]  (net tie, no BOM)
J23  NoLoad: N/L  [JRSM-40101]  (hidden comment: SMPM;SB;MALE;STRAIGHT;SMT;.152X.152X.150;PCB;R/A CONTACT)
J24  NoLoad: N/L  [JRSM-40101]  (hidden comment: SMPM;SB;MALE;STRAIGHT;SMT;.152X.152X.150;PCB;R/A CONTACT)
L2  value 4.3nH  [IND-0603HP]  (hidden comment: INDUCTOR;4.3;2%;7.5GHZ SRF;91Q @1.7GHZ;.08 DCR;1.3A;0603)
L3  value 4.3nH  [IND-0603HP]  (hidden comment: INDUCTOR;4.3;2%;7.5GHZ SRF;91Q @1.7GHZ;.08 DCR;1.3A;0603)
L4  value 8.7nH  [IND-0603HP]  (hidden comment: INDUCTOR;8.7NH;2%;5.5G SRF;149Q @1.7G;.054 DCR;1.4A;0603)
L6  value 3.9nH  [IND-0603HP]  (hidden comment: INDUCTOR;3.9;2%;7.5GHZ SRF;108Q @1.7GHZ;.039 DCR;1.6A;0603)
L7  value 3.9nH  [IND-0603HP]  (hidden comment: INDUCTOR;3.9;2%;7.5GHZ SRF;108Q @1.7GHZ;.039 DCR;1.6A;0603)
L46  value 3.3nH  [IND-0603HP]  (hidden comment: INDUCTOR;3.3NH;2%;9.6G SRF;104Q @1.7G;.024 DCR;1.9A;0603)
L52  value 3.3nH  [IND-0603HP]  (hidden comment: INDUCTOR;3.3NH;2%;9.6G SRF;104Q @1.7G;.024 DCR;1.9A;0603)
L53  value 3.3nH  [IND-0603HP]  (hidden comment: INDUCTOR;3.3NH;2%;9.6G SRF;104Q @1.7G;.024 DCR;1.9A;0603)
L58  value 3.3nH  [IND-0603HP]  (hidden comment: INDUCTOR;3.3NH;2%;9.6G SRF;104Q @1.7G;.024 DCR;1.9A;0603)
L60  value 3.3nH  [IND-0603HP]  (hidden comment: INDUCTOR;3.3NH;2%;9.6G SRF;104Q @1.7G;.024 DCR;1.9A;0603)
L61  value 3.3nH  [IND-0603HP]  (hidden comment: INDUCTOR;3.3NH;2%;9.6G SRF;104Q @1.7G;.024 DCR;1.9A;0603)
L62  value 3.3nH  [IND-0603HP]  (hidden comment: INDUCTOR;3.3NH;2%;9.6G SRF;104Q @1.7G;.024 DCR;1.9A;0603)
L63  value 3.3nH  [IND-0603HP]  (hidden comment: INDUCTOR;3.3NH;2%;9.6G SRF;104Q @1.7G;.024 DCR;1.9A;0603)
L64  value 4.7nH  [IND-0603HP]  (hidden comment: INDUCTOR;4.7;2%;7.9GHZ SRF;75Q @1.7GHZ;.1 DCR;1.1A;0603)
L70  value 4.7nH  [IND-0603HP]  (hidden comment: INDUCTOR;4.7;2%;7.9GHZ SRF;75Q @1.7GHZ;.1 DCR;1.1A;0603)
L72  value 4.7nH  [IND-0603HP]  (hidden comment: INDUCTOR;4.7;2%;7.9GHZ SRF;75Q @1.7GHZ;.1 DCR;1.1A;0603)
L74  value 4.7nH  [IND-0603HP]  (hidden comment: INDUCTOR;4.7;2%;7.9GHZ SRF;75Q @1.7GHZ;.1 DCR;1.1A;0603)
L75  value 3.9nH  [IND-0603HP]  (hidden comment: INDUCTOR;3.9;2%;7.5GHZ SRF;108Q @1.7GHZ;.039 DCR;1.6A;0603)
L80  value 3.9nH  [IND-0603HP]  (hidden comment: INDUCTOR;3.9;2%;7.5GHZ SRF;108Q @1.7GHZ;.039 DCR;1.6A;0603)
L81  value 3.9nH  [IND-0603HP]  (hidden comment: INDUCTOR;3.9;2%;7.5GHZ SRF;108Q @1.7GHZ;.039 DCR;1.6A;0603)
L82  value 3.9nH  [IND-0603HP]  (hidden comment: INDUCTOR;3.9;2%;7.5GHZ SRF;108Q @1.7GHZ;.039 DCR;1.6A;0603)
L83  value 3.3nH  [IND-0603HP]  (hidden comment: INDUCTOR;3.3NH;2%;9.6G SRF;104Q @1.7G;.024 DCR;1.9A;0603)
L86  value 3.3nH  [IND-0603HP]  (hidden comment: INDUCTOR;3.3NH;2%;9.6G SRF;104Q @1.7G;.024 DCR;1.9A;0603)
L87  value 3.3nH  [IND-0603HP]  (hidden comment: INDUCTOR;3.3NH;2%;9.6G SRF;104Q @1.7G;.024 DCR;1.9A;0603)
L91  value 15nH  [IND-0402HP]  (hidden comment: INDUCTOR;15NH;2%;3.9GHZ SRF;85Q @1.7GHZ;.078 DCR;1.1A;0402)
L92  value 3.3nH  [IND-0603HP]  (hidden comment: INDUCTOR;3.3NH;2%;9.6G SRF;104Q @1.7G;.024 DCR;1.9A;0603)
L93  value 1.8nH  [IND-0603HP]  (hidden comment: INDUCTOR;1.8NH;5%;16G SRF;65Q @1.7G;.18 DCR;.033A;0603)
L94  value 1.8nH  [IND-0603HP]  (hidden comment: INDUCTOR;1.8NH;5%;16G SRF;65Q @1.7G;.18 DCR;.033A;0603)
L95  value 1.8nH  [IND-0603HP]  (hidden comment: INDUCTOR;1.8NH;5%;16G SRF;65Q @1.7G;.18 DCR;.033A;0603)
L96  value 15nH  [IND-0402HP]  (hidden comment: INDUCTOR;15NH;2%;3.9GHZ SRF;85Q @1.7GHZ;.078 DCR;1.1A;0402)
L97  value 1.8nH  [IND-0603HP]  (hidden comment: INDUCTOR;1.8NH;5%;16G SRF;65Q @1.7G;.18 DCR;.033A;0603)
L98  value 15nH  [IND-0402HP]  (hidden comment: INDUCTOR;15NH;2%;3.9GHZ SRF;85Q @1.7GHZ;.078 DCR;1.1A;0402)
L99  value 15nH  [IND-0402HP]  (hidden comment: INDUCTOR;15NH;2%;3.9GHZ SRF;85Q @1.7GHZ;.078 DCR;1.1A;0402)
L100  value 15nH  [IND-0402HP]  (hidden comment: INDUCTOR;15NH;2%;3.9GHZ SRF;85Q @1.7GHZ;.078 DCR;1.1A;0402)
L101  value 15nH  [IND-0402HP]  (hidden comment: INDUCTOR;15NH;2%;3.9GHZ SRF;85Q @1.7GHZ;.078 DCR;1.1A;0402)
L102  value 15nH  [IND-0402HP]  (hidden comment: INDUCTOR;15NH;2%;3.9GHZ SRF;85Q @1.7GHZ;.078 DCR;1.1A;0402)
L103  value 15nH  [IND-0402HP]  (hidden comment: INDUCTOR;15NH;2%;3.9GHZ SRF;85Q @1.7GHZ;.078 DCR;1.1A;0402)
L104  value 15nH  [IND-0402HP]  (hidden comment: INDUCTOR;15NH;2%;3.9GHZ SRF;85Q @1.7GHZ;.078 DCR;1.1A;0402)
L105  value 15nH  [IND-0402HP]  (hidden comment: INDUCTOR;15NH;2%;3.9GHZ SRF;85Q @1.7GHZ;.078 DCR;1.1A;0402)
L106  value 15nH  [IND-0402HP]  (hidden comment: INDUCTOR;15NH;2%;3.9GHZ SRF;85Q @1.7GHZ;.078 DCR;1.1A;0402)
L107  value 15nH  [IND-0402HP]  (hidden comment: INDUCTOR;15NH;2%;3.9GHZ SRF;85Q @1.7GHZ;.078 DCR;1.1A;0402)
L108  value 15nH  [IND-0402HP]  (hidden comment: INDUCTOR;15NH;2%;3.9GHZ SRF;85Q @1.7GHZ;.078 DCR;1.1A;0402)
L109  value 15nH  [IND-0402HP]  (hidden comment: INDUCTOR;15NH;2%;3.9GHZ SRF;85Q @1.7GHZ;.078 DCR;1.1A;0402)
L110  value 15nH  [IND-0402HP]  (hidden comment: INDUCTOR;15NH;2%;3.9GHZ SRF;85Q @1.7GHZ;.078 DCR;1.1A;0402)
L111  value 15nH  [IND-0402HP]  (hidden comment: INDUCTOR;15NH;2%;3.9GHZ SRF;85Q @1.7GHZ;.078 DCR;1.1A;0402)
L112  value 15nH  [IND-0402HP]  (hidden comment: INDUCTOR;15NH;2%;3.9GHZ SRF;85Q @1.7GHZ;.078 DCR;1.1A;0402)
L113  value 15nH  [IND-0402HP]  (hidden comment: INDUCTOR;15NH;2%;3.9GHZ SRF;85Q @1.7GHZ;.078 DCR;1.1A;0402)
L114  value 15nH  [IND-0402HP]  (hidden comment: INDUCTOR;15NH;2%;3.9GHZ SRF;85Q @1.7GHZ;.078 DCR;1.1A;0402)
L115  value 15nH  [IND-0402HP]  (hidden comment: INDUCTOR;15NH;2%;3.9GHZ SRF;85Q @1.7GHZ;.078 DCR;1.1A;0402)
L116  value 15nH  [IND-0402HP]  (hidden comment: INDUCTOR;15NH;2%;3.9GHZ SRF;85Q @1.7GHZ;.078 DCR;1.1A;0402)
L117  value 15nH  [IND-0402HP]  (hidden comment: INDUCTOR;15NH;2%;3.9GHZ SRF;85Q @1.7GHZ;.078 DCR;1.1A;0402)
L118  value 15nH  [IND-0402HP]  (hidden comment: INDUCTOR;15NH;2%;3.9GHZ SRF;85Q @1.7GHZ;.078 DCR;1.1A;0402)
L138  value 15nH  [IND-0402HP]  (hidden comment: INDUCTOR;15NH;2%;3.9GHZ SRF;85Q @1.7GHZ;.078 DCR;1.1A;0402)
L167  value 15nH  [IND-0402HP]  (hidden comment: INDUCTOR;15NH;2%;3.9GHZ SRF;85Q @1.7GHZ;.078 DCR;1.1A;0402)
L204  value 15nH  [IND-0402HP]  (hidden comment: INDUCTOR;15NH;2%;3.9GHZ SRF;85Q @1.7GHZ;.078 DCR;1.1A;0402)
L205  value 15nH  [IND-0402HP]  (hidden comment: INDUCTOR;15NH;2%;3.9GHZ SRF;85Q @1.7GHZ;.078 DCR;1.1A;0402)
L207  value 15nH  [IND-0402HP]  (hidden comment: INDUCTOR;15NH;2%;3.9GHZ SRF;85Q @1.7GHZ;.078 DCR;1.1A;0402)
L208  value 15nH  [IND-0402HP]  (hidden comment: INDUCTOR;15NH;2%;3.9GHZ SRF;85Q @1.7GHZ;.078 DCR;1.1A;0402)
L209  value 15nH  [IND-0402HP]  (hidden comment: INDUCTOR;15NH;2%;3.9GHZ SRF;85Q @1.7GHZ;.078 DCR;1.1A;0402)
L210  value 15nH  [IND-0402HP]  (hidden comment: INDUCTOR;15NH;2%;3.9GHZ SRF;85Q @1.7GHZ;.078 DCR;1.1A;0402)
L211  value 15nH  [IND-0402HP]  (hidden comment: INDUCTOR;15NH;2%;3.9GHZ SRF;85Q @1.7GHZ;.078 DCR;1.1A;0402)
L212  value 15nH  [IND-0402HP]  (hidden comment: INDUCTOR;15NH;2%;3.9GHZ SRF;85Q @1.7GHZ;.078 DCR;1.1A;0402)
L213  value 15nH  [IND-0402HP]  (hidden comment: INDUCTOR;15NH;2%;3.9GHZ SRF;85Q @1.7GHZ;.078 DCR;1.1A;0402)
L214  value 15nH  [IND-0402HP]  (hidden comment: INDUCTOR;15NH;2%;3.9GHZ SRF;85Q @1.7GHZ;.078 DCR;1.1A;0402)
L215  value 15nH  [IND-0402HP]  (hidden comment: INDUCTOR;15NH;2%;3.9GHZ SRF;85Q @1.7GHZ;.078 DCR;1.1A;0402)
L216  value 15nH  [IND-0402HP]  (hidden comment: INDUCTOR;15NH;2%;3.9GHZ SRF;85Q @1.7GHZ;.078 DCR;1.1A;0402)
L217  value 15nH  [IND-0402HP]  (hidden comment: INDUCTOR;15NH;2%;3.9GHZ SRF;85Q @1.7GHZ;.078 DCR;1.1A;0402)
L218  value 15nH  [IND-0402HP]  (hidden comment: INDUCTOR;15NH;2%;3.9GHZ SRF;85Q @1.7GHZ;.078 DCR;1.1A;0402)
L219  value 15nH  [IND-0402HP]  (hidden comment: INDUCTOR;15NH;2%;3.9GHZ SRF;85Q @1.7GHZ;.078 DCR;1.1A;0402)
L220  value 15nH  [IND-0402HP]  (hidden comment: INDUCTOR;15NH;2%;3.9GHZ SRF;85Q @1.7GHZ;.078 DCR;1.1A;0402)
L221  value 15nH  [IND-0402HP]  (hidden comment: INDUCTOR;15NH;2%;3.9GHZ SRF;85Q @1.7GHZ;.078 DCR;1.1A;0402)
L222  value 15nH  [IND-0402HP]  (hidden comment: INDUCTOR;15NH;2%;3.9GHZ SRF;85Q @1.7GHZ;.078 DCR;1.1A;0402)
L223  value 15nH  [IND-0402HP]  (hidden comment: INDUCTOR;15NH;2%;3.9GHZ SRF;85Q @1.7GHZ;.078 DCR;1.1A;0402)
L224  value 15nH  [IND-0402HP]  (hidden comment: INDUCTOR;15NH;2%;3.9GHZ SRF;85Q @1.7GHZ;.078 DCR;1.1A;0402)
L225  value 15nH  [IND-0402HP]  (hidden comment: INDUCTOR;15NH;2%;3.9GHZ SRF;85Q @1.7GHZ;.078 DCR;1.1A;0402)
R1  value 49.9  [RES-0402-N]  (hidden comment: 49.9 OHMS;.06W;1%;200PPM;FILM;CHIP;0402)
R3  value 49.9  [RES-0402-N]  (hidden comment: 49.9 OHMS;.06W;1%;200PPM;FILM;CHIP;0402)
R4  value 39.2  [RES-2010-N]  (hidden comment: 39.2 OHM;.75W;1%;100PPM;FILM CHIP;2010)
R171  value 107  [RES-2010-N]  (hidden comment: 107 OHMS;0.75W;1%;100PPM;THICK FILM;CHIP;2010;RoHS)
R178  value 0  [RES-0603-N]  (hidden comment: JUMPER;.05 OHMS MAX;1A MAX;0603)
R179  value 0  [RES-0603-N]  (hidden comment: JUMPER;.05 OHMS MAX;1A MAX;0603)
R180  value 0  [RES-0603-N]  (hidden comment: JUMPER;.05 OHMS MAX;1A MAX;0603)
R181  value 0  [RES-0603-N]  (hidden comment: JUMPER;.05 OHMS MAX;1A MAX;0603)
R182  value 0  [RES-0603-N]  (hidden comment: JUMPER;.05 OHMS MAX;1A MAX;0603)
R183  value 0  [RES-0603-N]  (hidden comment: JUMPER;.05 OHMS MAX;1A MAX;0603)
R319  value 24.9  [RES-0402-N]  (hidden comment: 24.9 OHMS;.06W;1%;200PPM;FILM;CHIP;0402)
R322  value 24.9  [RES-0402-N]  (hidden comment: 24.9 OHMS;.06W;1%;200PPM;FILM;CHIP;0402)
R401  value 49.9  [RES-0402-N]  (hidden comment: 49.9 OHMS;.06W;1%;200PPM;FILM;CHIP;0402)
R596  value 49.9  [RES-0402-N]  (hidden comment: 49.9 OHMS;.06W;1%;200PPM;FILM;CHIP;0402)
R597  value 49.9  [RES-0402-N]  (hidden comment: 49.9 OHMS;.06W;1%;200PPM;FILM;CHIP;0402)
R598  value 49.9  [RES-0402-N]  (hidden comment: 49.9 OHMS;.06W;1%;200PPM;FILM;CHIP;0402)
R599  value 39.2  [RES-2010-N]  (hidden comment: 39.2 OHM;.75W;1%;100PPM;FILM CHIP;2010)
R600  value 49.9  [RES-0402-N]  (hidden comment: 49.9 OHMS;.06W;1%;200PPM;FILM;CHIP;0402)
R601  value 49.9  [RES-0402-N]  (hidden comment: 49.9 OHMS;.06W;1%;200PPM;FILM;CHIP;0402)
R602  value 49.9  [RES-0402-N]  (hidden comment: 49.9 OHMS;.06W;1%;200PPM;FILM;CHIP;0402)
R603  value 49.9  [RES-0402-N]  (hidden comment: 49.9 OHMS;.06W;1%;200PPM;FILM;CHIP;0402)
R604  value 49.9  [RES-0402-N]  (hidden comment: 49.9 OHMS;.06W;1%;200PPM;FILM;CHIP;0402)
R605  value 49.9  [RES-0402-N]  (hidden comment: 49.9 OHMS;.06W;1%;200PPM;FILM;CHIP;0402)
R616  value 24.9  [RES-0402-N]  (hidden comment: 24.9 OHMS;.06W;1%;200PPM;FILM;CHIP;0402)
R617  value 24.9  [RES-0402-N]  (hidden comment: 24.9 OHMS;.06W;1%;200PPM;FILM;CHIP;0402)
R618  value 24.9  [RES-0402-N]  (hidden comment: 24.9 OHMS;.06W;1%;200PPM;FILM;CHIP;0402)
R619  value 24.9  [RES-0402-N]  (hidden comment: 24.9 OHMS;.06W;1%;200PPM;FILM;CHIP;0402)
R620  value 24.9  [RES-0402-N]  (hidden comment: 24.9 OHMS;.06W;1%;200PPM;FILM;CHIP;0402)
R621  value 24.9  [RES-0402-N]  (hidden comment: 24.9 OHMS;.06W;1%;200PPM;FILM;CHIP;0402)
R622  value 24.9  [RES-0402-N]  (hidden comment: 24.9 OHMS;.06W;1%;200PPM;FILM;CHIP;0402)
R623  value 24.9  [RES-0402-N]  (hidden comment: 24.9 OHMS;.06W;1%;200PPM;FILM;CHIP;0402)
R624  value 24.9  [RES-0402-N]  (hidden comment: 24.9 OHMS;.06W;1%;200PPM;FILM;CHIP;0402)
R625  value 24.9  [RES-0402-N]  (hidden comment: 24.9 OHMS;.06W;1%;200PPM;FILM;CHIP;0402)
R626  value 24.9  [RES-0402-N]  (hidden comment: 24.9 OHMS;.06W;1%;200PPM;FILM;CHIP;0402)
R627  value 24.9  [RES-0402-N]  (hidden comment: 24.9 OHMS;.06W;1%;200PPM;FILM;CHIP;0402)
R628  value 24.9  [RES-0402-N]  (hidden comment: 24.9 OHMS;.06W;1%;200PPM;FILM;CHIP;0402)
R629  value 24.9  [RES-0402-N]  (hidden comment: 24.9 OHMS;.06W;1%;200PPM;FILM;CHIP;0402)
R630  value 24.9  [RES-0402-N]  (hidden comment: 24.9 OHMS;.06W;1%;200PPM;FILM;CHIP;0402)
R631  value 24.9  [RES-0402-N]  (hidden comment: 24.9 OHMS;.06W;1%;200PPM;FILM;CHIP;0402)
R632  value 24.9  [RES-0402-N]  (hidden comment: 24.9 OHMS;.06W;1%;200PPM;FILM;CHIP;0402)
R633  value 24.9  [RES-0402-N]  (hidden comment: 24.9 OHMS;.06W;1%;200PPM;FILM;CHIP;0402)
R634  value 24.9  [RES-0402-N]  (hidden comment: 24.9 OHMS;.06W;1%;200PPM;FILM;CHIP;0402)
R635  value 24.9  [RES-0402-N]  (hidden comment: 24.9 OHMS;.06W;1%;200PPM;FILM;CHIP;0402)
R636  value 20  [RES-0201-N]  (hidden comment: 20 OHMS;.05W;1%;200PPM;FILM CHIP;0201)
R637  value 20  [RES-0201-N]  (hidden comment: 20 OHMS;.05W;1%;200PPM;FILM CHIP;0201)
R638  value 24.9  [RES-0402-N]  (hidden comment: 24.9 OHMS;.06W;1%;200PPM;FILM;CHIP;0402)
R639  value 24.9  [RES-0402-N]  (hidden comment: 24.9 OHMS;.06W;1%;200PPM;FILM;CHIP;0402)
R640  value 24.9  [RES-0402-N]  (hidden comment: 24.9 OHMS;.06W;1%;200PPM;FILM;CHIP;0402)
R641  value 24.9  [RES-0402-N]  (hidden comment: 24.9 OHMS;.06W;1%;200PPM;FILM;CHIP;0402)
R642  value 24.9  [RES-0402-N]  (hidden comment: 24.9 OHMS;.06W;1%;200PPM;FILM;CHIP;0402)
R643  value 24.9  [RES-0402-N]  (hidden comment: 24.9 OHMS;.06W;1%;200PPM;FILM;CHIP;0402)
R644  value 24.9  [RES-0402-N]  (hidden comment: 24.9 OHMS;.06W;1%;200PPM;FILM;CHIP;0402)
R645  value 24.9  [RES-0402-N]  (hidden comment: 24.9 OHMS;.06W;1%;200PPM;FILM;CHIP;0402)
R646  value 24.9  [RES-0402-N]  (hidden comment: 24.9 OHMS;.06W;1%;200PPM;FILM;CHIP;0402)
R647  value 24.9  [RES-0402-N]  (hidden comment: 24.9 OHMS;.06W;1%;200PPM;FILM;CHIP;0402)
R648  value 24.9  [RES-0402-N]  (hidden comment: 24.9 OHMS;.06W;1%;200PPM;FILM;CHIP;0402)
R649  value 24.9  [RES-0402-N]  (hidden comment: 24.9 OHMS;.06W;1%;200PPM;FILM;CHIP;0402)
U1  MIXER;UP CONV;5-3500MHZ IF IN;5-4200MHZ LO/RF;CD542;RoHS  [CD542]  (value not drawn)
U2  AMP;0-6GHZ;20DB;+20DBM;5V;100MA;SOT-89  [SOT-89]  (value not drawn)
U5  M_PN: HMC232LP4E  [QFN-24_HITTITE]  (hidden comment: MMIC SPDT;NON-REFLECTIVE;SWITCH;DC -12 GHz;RoHS)
U6  M_PN: HMC232LP4E  [QFN-24_HITTITE]  (hidden comment: MMIC SPDT;NON-REFLECTIVE;SWITCH;DC -12 GHz;RoHS)
U11  AMP;0-6GHZ;20DB;+20DBM;5V;100MA;SOT-89  [SOT-89]  (value not drawn)
U12  M_PN: HMC232LP4E  [QFN-24_HITTITE]  (hidden comment: MMIC SPDT;NON-REFLECTIVE;SWITCH;DC -12 GHz;RoHS)
U14  M_PN: MASWCC0006  [QFN36_MACOM]  (hidden comment: SWITCH;SP6T;DC-4GHZ;25DB ISO;20NS;27DBM P1;PQFN-36)
U16  M_PN: MASWCC0006  [QFN36_MACOM]  (hidden comment: SWITCH;SP6T;DC-4GHZ;25DB ISO;20NS;27DBM P1;PQFN-36)
U19  M_PN: HMC232LP4E  [QFN-24_HITTITE]  (hidden comment: MMIC SPDT;NON-REFLECTIVE;SWITCH;DC -12 GHz;RoHS)
U21  M_PN: HMC232LP4E  [QFN-24_HITTITE]  (hidden comment: MMIC SPDT;NON-REFLECTIVE;SWITCH;DC -12 GHz;RoHS)
U24  M_PN: HMC232LP4E  [QFN-24_HITTITE]  (hidden comment: MMIC SPDT;NON-REFLECTIVE;SWITCH;DC -12 GHz;RoHS)
U109  M_PN: HMC232LP4E  [QFN-24_HITTITE]  (hidden comment: MMIC SPDT;NON-REFLECTIVE;SWITCH;DC -12 GHz;RoHS)
U113  M_PN: HMC232LP4E  [QFN-24_HITTITE]  (hidden comment: MMIC SPDT;NON-REFLECTIVE;SWITCH;DC -12 GHz;RoHS)
U126  M_PN: HMC232LP4E  [QFN-24_HITTITE]  (hidden comment: MMIC SPDT;NON-REFLECTIVE;SWITCH;DC -12 GHz;RoHS)
U133  AMP;0-6GHZ;20DB;+20DBM;5V;100MA;SOT-89  [SOT-89]  (value not drawn)
U134  M_PN: HMC232LP4E  [QFN-24_HITTITE]  (hidden comment: MMIC SPDT;NON-REFLECTIVE;SWITCH;DC -12 GHz;RoHS)
U135  M_PN: HMC232LP4E  [QFN-24_HITTITE]  (hidden comment: MMIC SPDT;NON-REFLECTIVE;SWITCH;DC -12 GHz;RoHS)
U136  M_PN: HMC232LP4E  [QFN-24_HITTITE]  (hidden comment: MMIC SPDT;NON-REFLECTIVE;SWITCH;DC -12 GHz;RoHS)

### Ports
200_MHz_Comb, 2400MHz_Stalo, SRD_BANK_1_NEG, SRD_BANK_1_POS, SRD_BANK_2_NEG, SRD_BANK_2_POS, SRD_BANK_3_NEG, SRD_BANK_3_POS, SRD_BANK_4_NEG, SRD_BANK_4_POS, SRD_BANK_5_NEG, SRD_BANK_5_POS, SRD_BANK_6_NEG, SRD_BANK_6_POS, STALO_LO, ~{SRD_BANK_1_NEG}, ~{SRD_BANK_2_NEG}, ~{SRD_BANK_3_NEG}, ~{SRD_BANK_4_NEG}, ~{SRD_BANK_5_NEG}, ~{SRD_BANK_6_NEG}